# Altium schematic sheet P07-LCD.SchDoc
size 840 x 594 mm
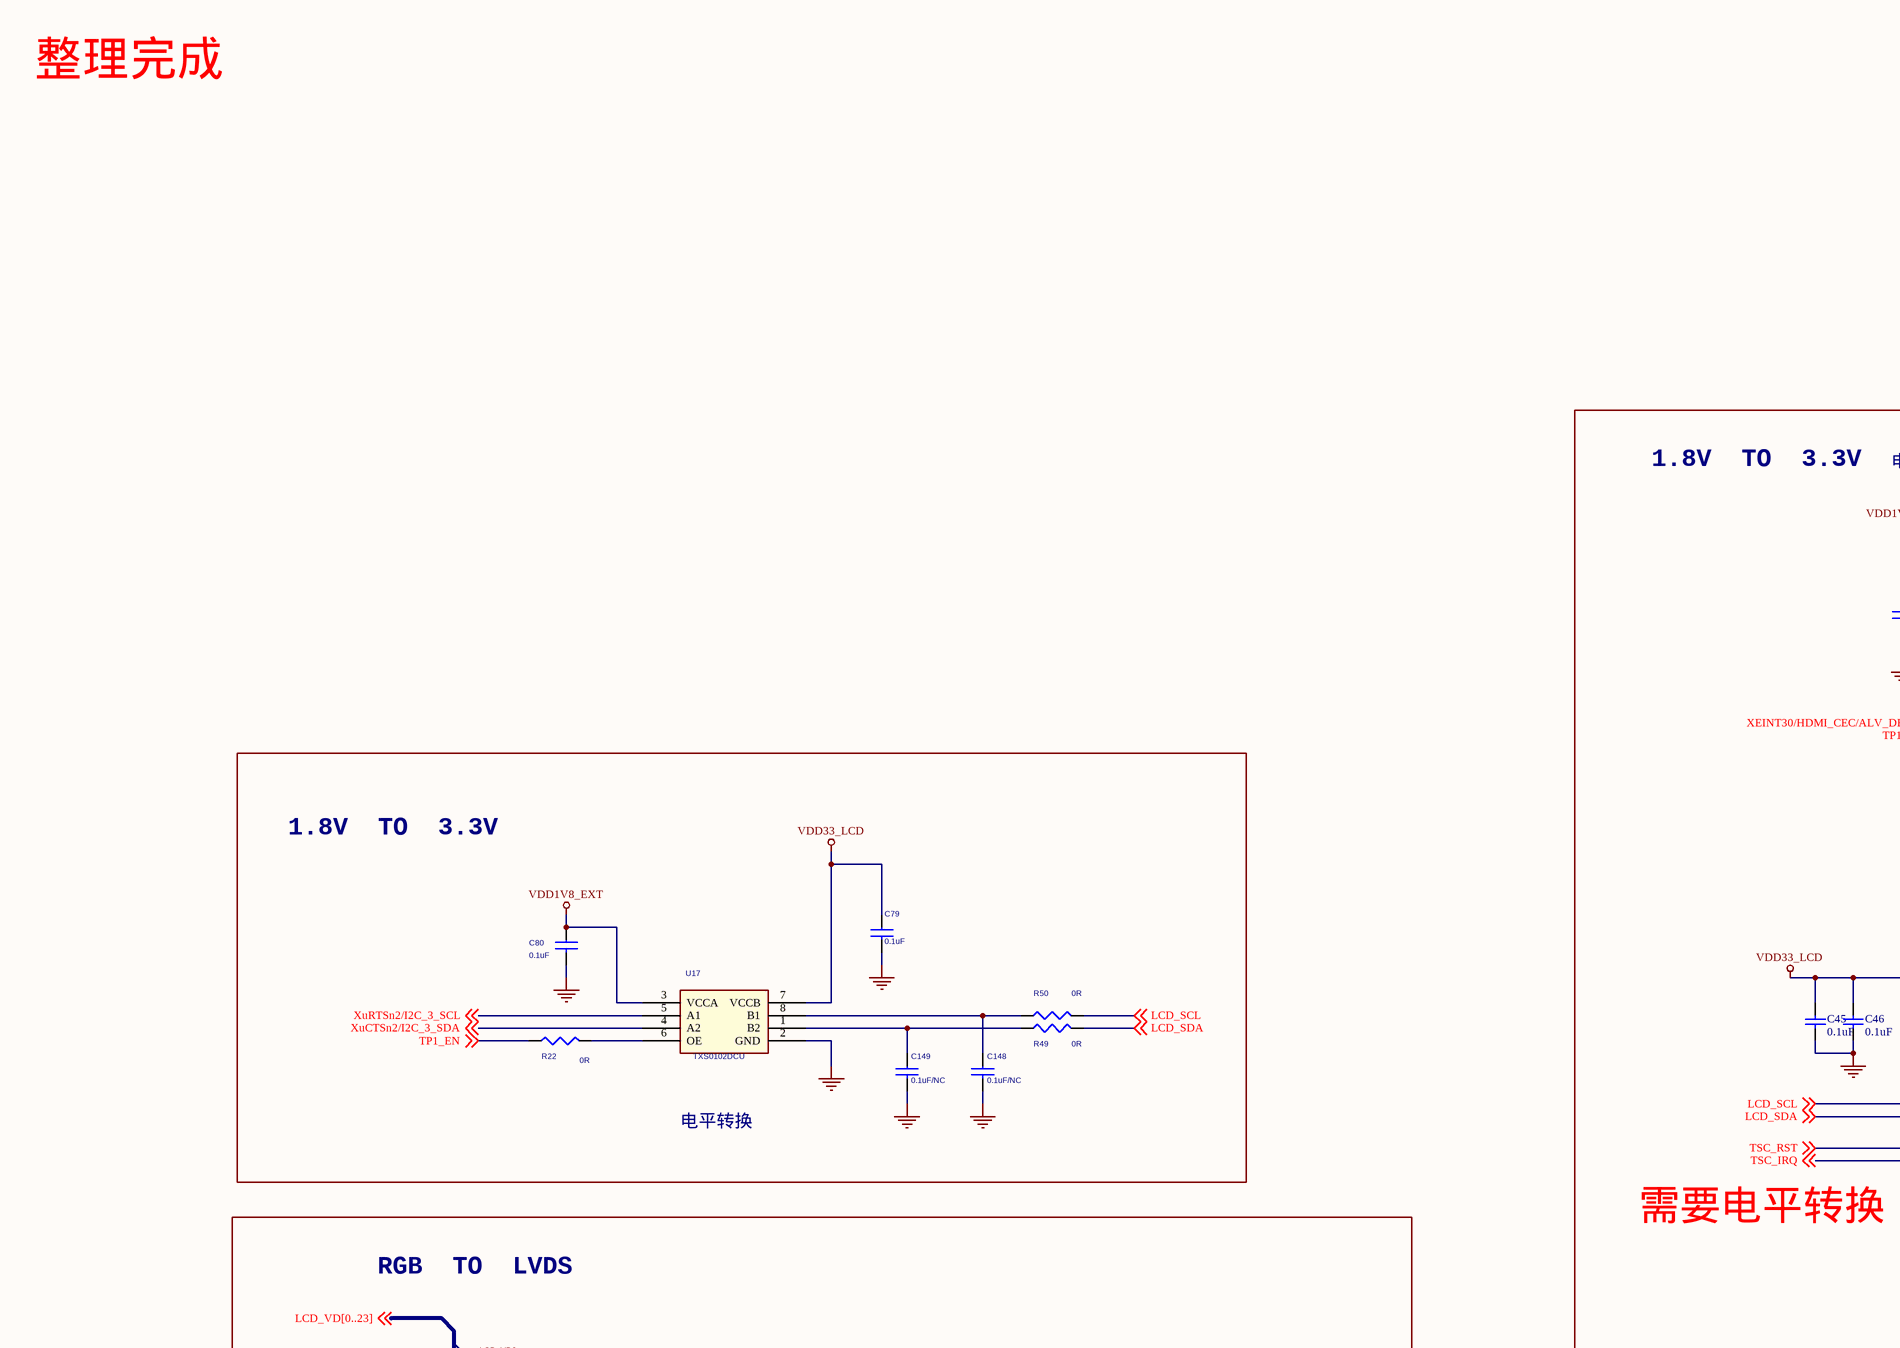
[diagram p0: P07-LCD.SchDoc, top left]
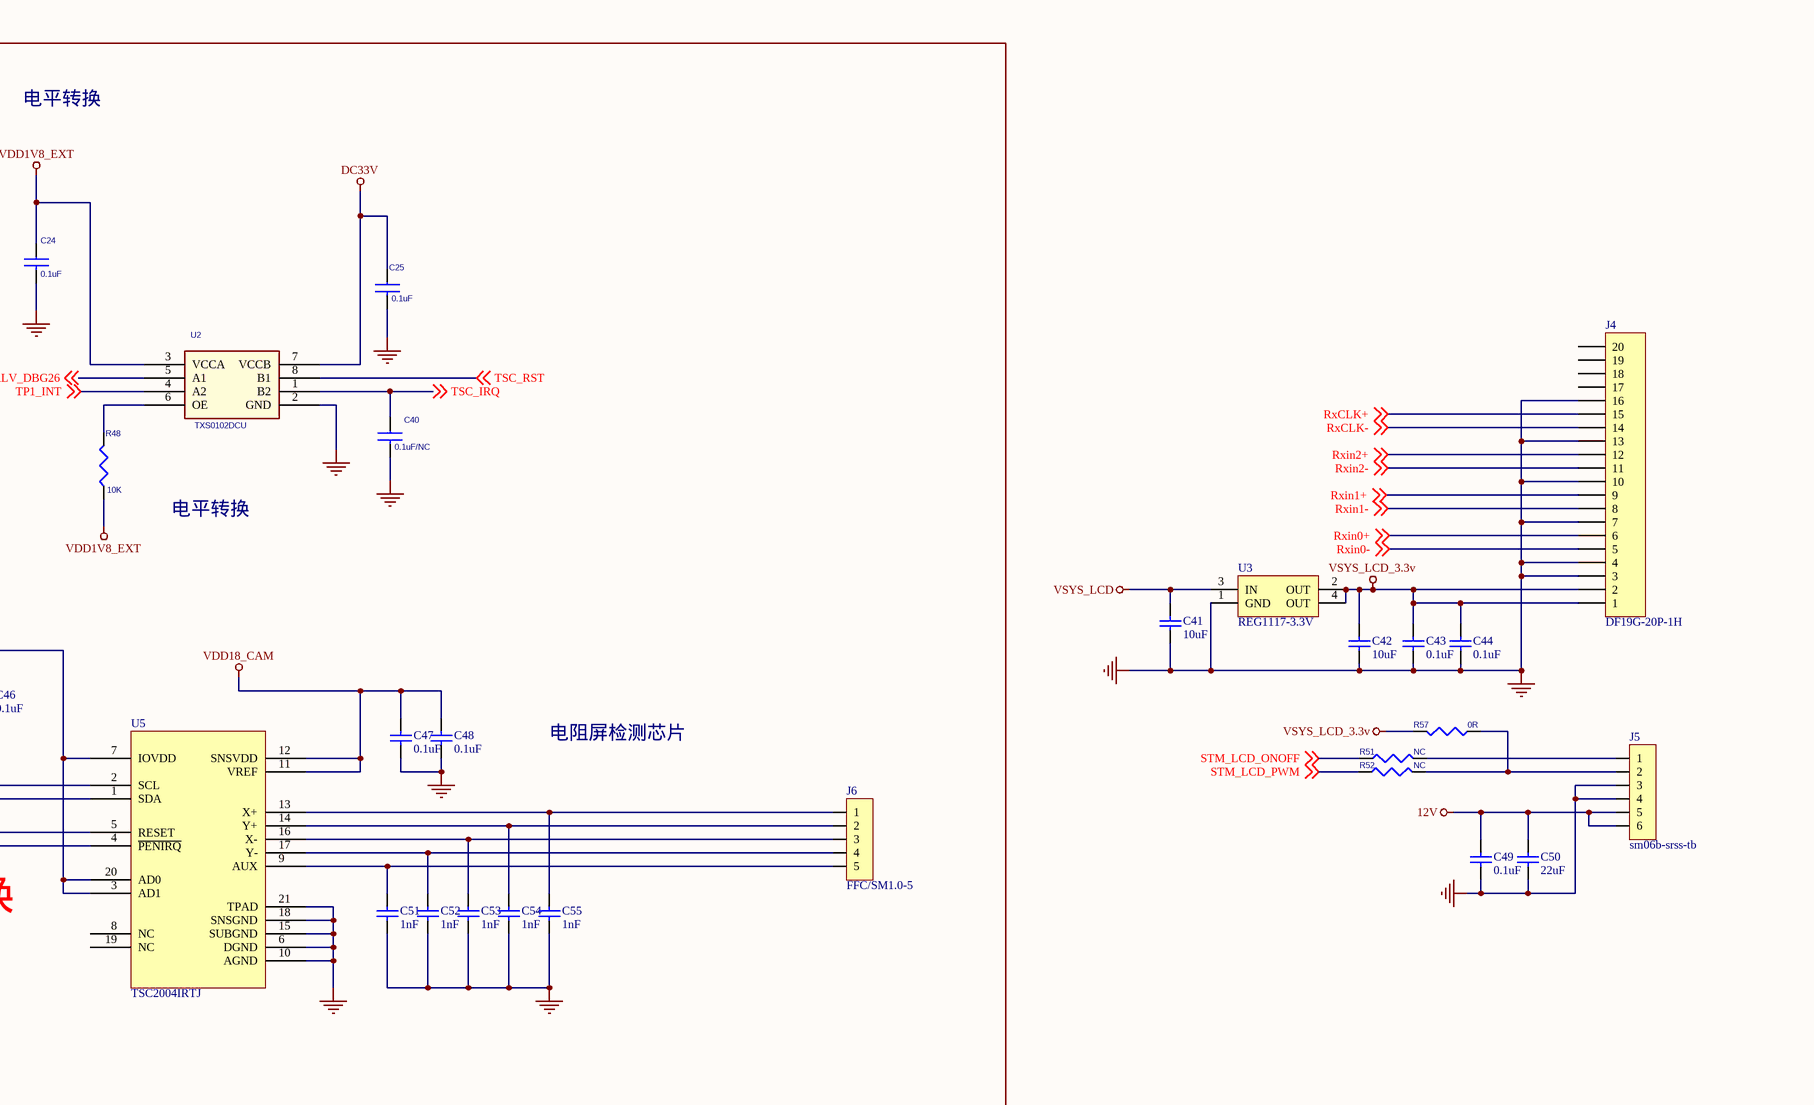
[diagram p1: P07-LCD.SchDoc, top right]
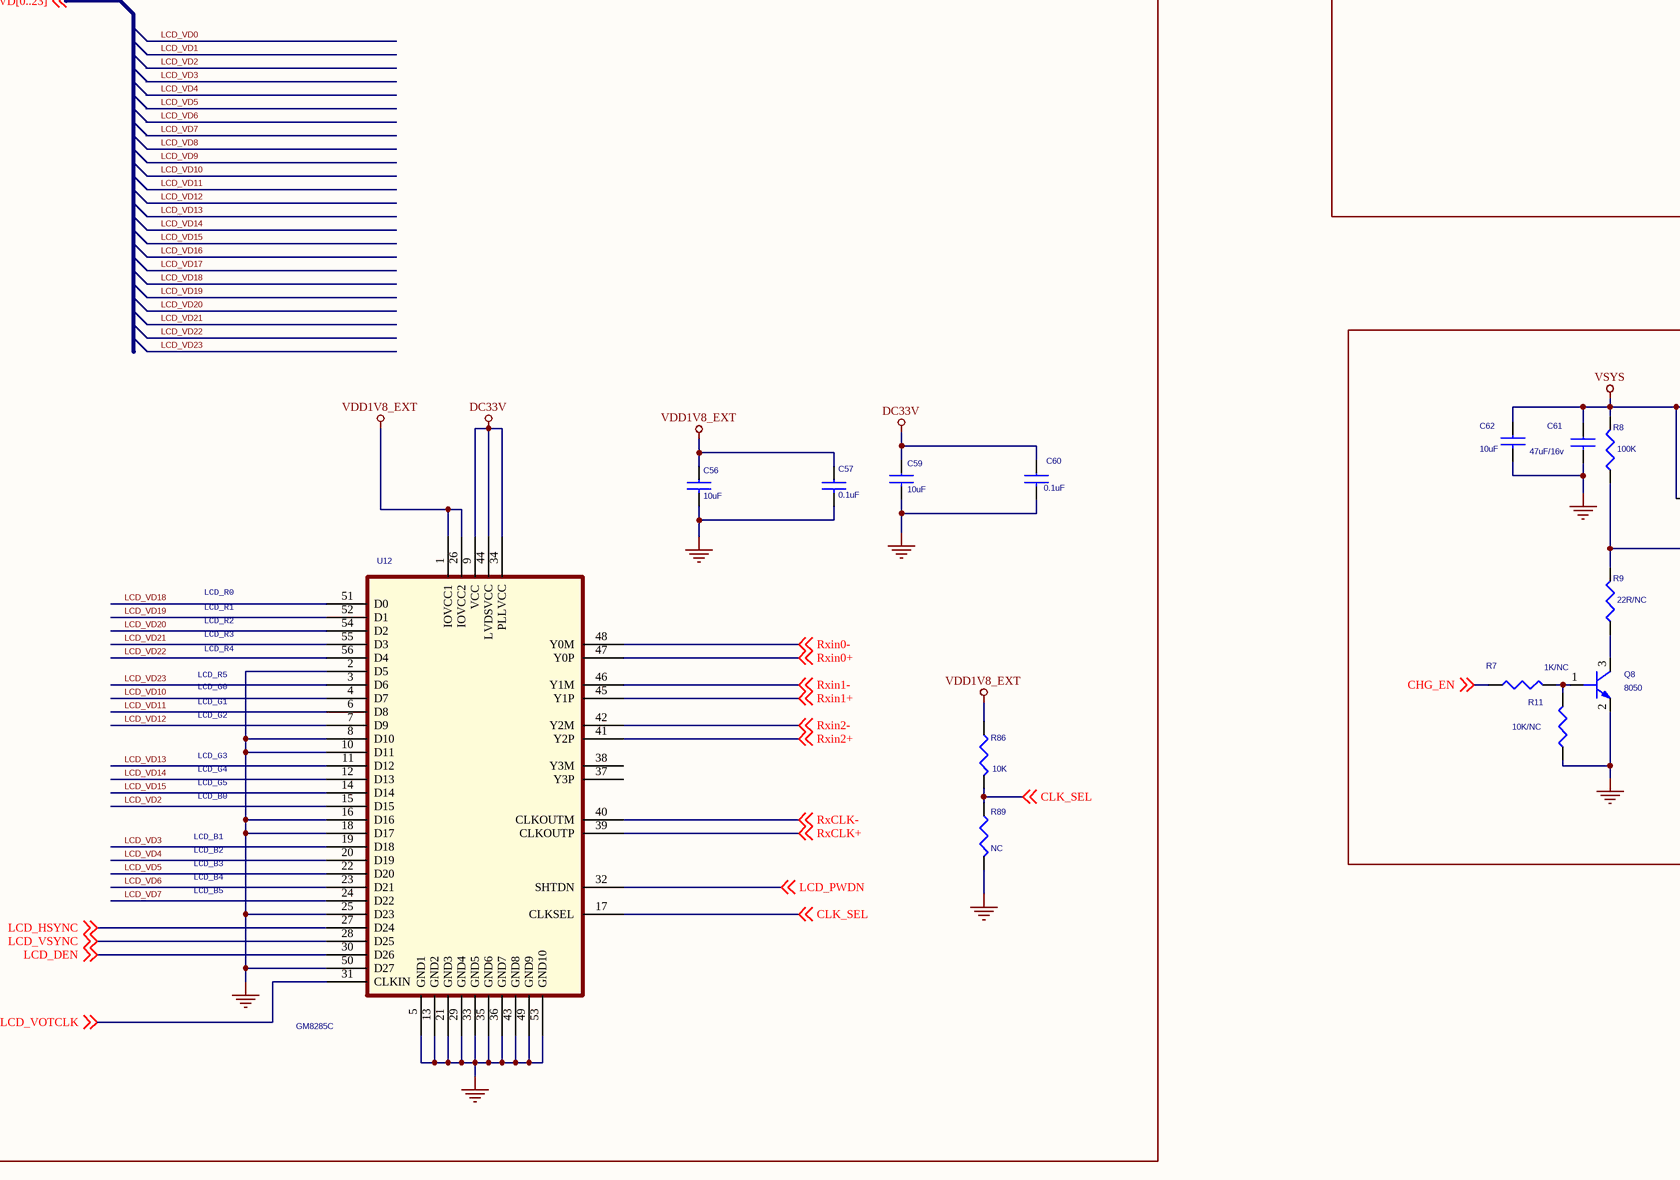
[diagram p2: P07-LCD.SchDoc, bottom left]
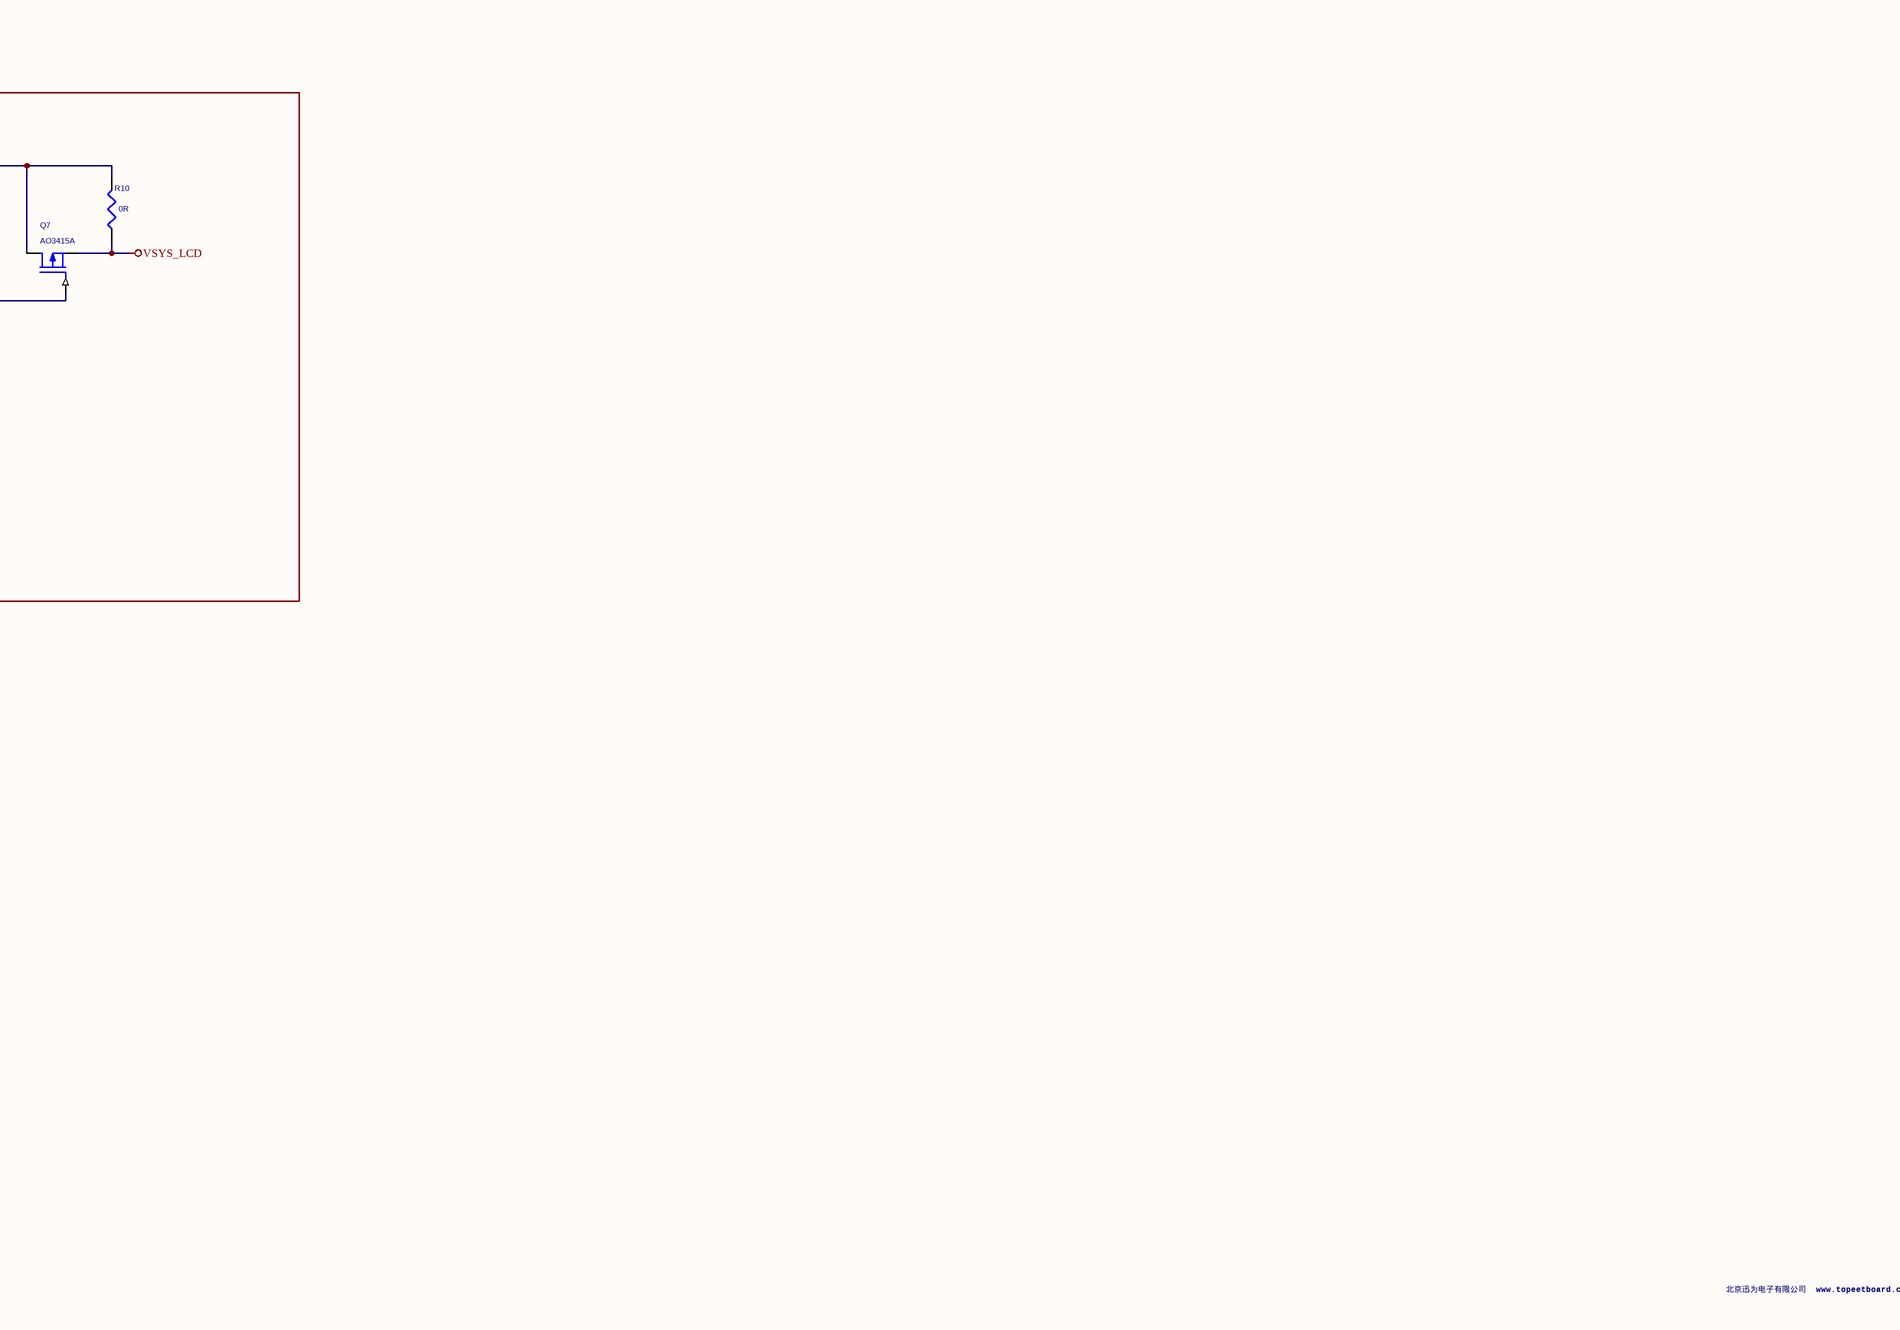
[diagram p3: P07-LCD.SchDoc, bottom right]

## Parts
C24  0.1uF  [C0603-S]
C25  0.1uF  [C0603-S]
C40  0.1uF/NC  [C0603-S]
C41  10uF  [C0603-s]
C42  10uF  [C0603-s]
C43  0.1uF  [C0603-s]
C44  0.1uF  [C0603-s]
C45  0.1uF  [C0603-S]
C46  0.1uF  [C0603-S]
C47  0.1uF  [C0603-S]
C48  0.1uF  [C0603-S]
C49  0.1uF  [C0603-s]
C50  22uF  [C0805-s]
C51  1nF  [C0603-S]
C52  1nF  [C0603-S]
C53  1nF  [C0603-S]
C54  1nF  [C0603-S]
C55  1nF  [C0603-S]
C56  10uF  [C0805-S]
C57  0.1uF  [C0603-S]
C59  10uF  [C0805-S]
C60  0.1uF  [C0603-S]
C61  47uF/16v  [C1206-S]
C62  10uF  [C0805-S]
C79  0.1uF  [C0603-S]
C80  0.1uF  [C0603-S]
C148  0.1uF/NC  [C0603-S]
C149  0.1uF/NC  [C0603-S]
J4  DF19G-20P-1H  [DF19G-20P-1H]
J5  sm06b-srss-tb  [sm06b-srss-tb]
J6  FFC/SM1.0-5  [FFC/SM1.0-5]
Q7  AO3415A  [SOT-23]
Q8  8050  [SOT-23]
R7  1K/NC  [R0603-S]
R8  100K  [R0603-S]
R9  22R/NC  [R0603-S]
R10  0R  [R0603-S]
R11  10K/NC  [R0603-S]
R22  0R  [R0603-S]
R48  10K  [R0603-S]
R49  0R  [R0603-S]
R50  0R  [R0603-S]
R51  NC  [R0603-S]
R52  NC  [R0603-S]
R57  0R  [R0603-S]
R86  10K  [R0603-S]
R89  NC  [R0603-S]
U2  TXS0102DCU  [tssop8]
U3  REG1117-3.3V  [SOT-223]
U5  TSC2004IRTJ  [QFN20]
U12  GM8285C  [TSSOP56]
U17  TXS0102DCU  [tssop8]

## Blocks framed on the sheet
需要电平转换: C24 C25 C40 C45-C48 C51-C55 J6 R48 U2 U5
1.8V  TO  3.3V: C79 C80 C148 C149 R22 R49 R50 U17
RGB  TO  LVDS: C56 C57 C59 C60 R86 R89 U12

## Nets
12V: C49.2 C50.2 J5.5 J5.6
DC33V: C25.1 C59.1 C60.1 U2.7(VCCB) U12.9(VCC) U12.34(PLLVCC) U12.44(LVDSVCC)
GND: C24.2 C25.2 C40.2 C41.1 C42.1 C43.1 C44.1 C45.1 C46.1 C47.1 C48.1 C49.1 C50.1 C51.1 C52.1 C53.1 C54.1 C55.1 C56.2 C57.2 C59.2 C60.2 C61.2 C62.2 C79.2 C80.2 C148.2 C149.2 J4.3 J4.4 J4.7 J4.10 J4.13 J4.16 J5.3 J5.4 Q8.2(EMITTER) R11.2 R89.2 U2.2(GND) U3.1(GND) U5.6(DGND) U5.10(AGND) U5.15(SUBGND) U5.18(SNSGND) U5.21(TPAD) U12.2(D5) U12.5(GND1) U12.8(D10) U12.10(D11) U12.13(GND2) U12.16(D16) U12.18(D17) U12.21(GND3) U12.25(D23) U12.29(GND4) U12.33(GND5) U12.35(GND6) U12.36(GND7) U12.43(GND8) U12.49(GND9) U12.50(D27) U12.53(GND10) U17.2(GND)
VDD1V8_EXT: C24.1 C56.1 C57.1 C80.1 R48.1 R86.1 U2.3(VCCA) U12.1(IOVCC1) U12.26(IOVCC2) U17.3(VCCA)
VDD18_CAM: C47.2 C48.2 U5.11(VREF) U5.12(SNSVDD)
VDD33_LCD: C45.2 C46.2 C79.1 U5.3(AD1) U5.7(IOVDD) U5.20(AD0) U17.7(VCCB)
VSYS: C61.1 C62.1 Q7.2(DRAIN) R8.1 R10.1
VSYS_LCD: C41.2 Q7.3(SOURCE) R10.2 U3.3(IN)
VSYS_LCD_3.3v: C42.2 C43.2 C44.2 J4.1 J4.2 R57.2 U3.2(OUT) U3.4(OUT)
CHG_EN: R7.2 ; off-sheet CHG_EN
CLK_SEL: R86.2 R89.1 U12.17(CLKSEL) ; off-sheet CLK_SEL
LCD_DEN: U12.30(D26) ; off-sheet LCD_DEN
LCD_HSYNC: U12.27(D24) ; off-sheet LCD_HSYNC
LCD_PWDN: U12.32(SHTDN) ; off-sheet LCD_PWDN
LCD_SCL: R50.2 U5.2(SCL) ; off-sheet LCD_SCL
LCD_SDA: R49.2 U5.1(SDA) ; off-sheet LCD_SDA
LCD_VD2: U12.15(D15)
LCD_VD3: U12.19(D18)
LCD_VD4: U12.20(D19)
LCD_VD5: U12.22(D20)
LCD_VD6: U12.23(D21)
LCD_VD7: U12.24(D22)
LCD_VD10: U12.4(D7)
LCD_VD11: U12.6(D8)
LCD_VD12: U12.7(D9)
LCD_VD13: U12.11(D12)
LCD_VD14: U12.12(D13)
LCD_VD15: U12.14(D14)
LCD_VD18: U12.51(D0)
LCD_VD19: U12.52(D1)
LCD_VD20: U12.54(D2)
LCD_VD21: U12.55(D3)
LCD_VD22: U12.56(D4)
LCD_VD23: U12.3(D6)
LCD_VOTCLK: U12.31(CLKIN) ; off-sheet LCD_VOTCLK
LCD_VSYNC: U12.28(D25) ; off-sheet LCD_VSYNC
RxCLK+: J4.15 U12.39(CLKOUTP) ; off-sheet RxCLK+
RxCLK-: J4.14 U12.40(CLKOUTM) ; off-sheet RxCLK-
Rxin0+: J4.6 U12.47(Y0P) ; off-sheet Rxin0+
Rxin0-: J4.5 U12.48(Y0M) ; off-sheet Rxin0-
Rxin1+: J4.9 U12.45(Y1P) ; off-sheet Rxin1+
Rxin1-: J4.8 U12.46(Y1M) ; off-sheet Rxin1-
Rxin2+: J4.12 U12.41(Y2P) ; off-sheet Rxin2+
Rxin2-: J4.11 U12.42(Y2M) ; off-sheet Rxin2-
STM_LCD_ONOFF: R51.1 ; off-sheet STM_LCD_ONOFF
STM_LCD_PWM: R52.1 ; off-sheet STM_LCD_PWM
TP1_EN: R22.1 ; off-sheet TP1_EN
TP1_INT: U2.4(A2) ; off-sheet TP1_INT
TSC_IRQ: C40.1 U2.1(B2) U5.4(~{PENIRQ}) ; off-sheet TSC_IRQ
TSC_RST: U2.8(B1) U5.5(RESET) ; off-sheet TSC_RST
XEINT30/HDMI_CEC/ALV_DBG26: U2.5(A1) ; off-sheet XEINT30/HDMI_CEC/ALV_DBG26
XuCTSn2/I2C_3_SDA: U17.4(A2) ; off-sheet XuCTSn2/I2C_3_SDA
XuRTSn2/I2C_3_SCL: U17.5(A1) ; off-sheet XuRTSn2/I2C_3_SCL
NetC51_2: C51.2 J6.5 U5.9(AUX)
NetC52_2: C52.2 J6.4 U5.17(Y-)
NetC53_2: C53.2 J6.3 U5.16(X-)
NetC54_2: C54.2 J6.2 U5.14(Y+)
NetC55_2: C55.2 J6.1 U5.13(X+)
NetC148_1: C148.1 R50.1 U17.8(B1)
NetC149_1: C149.1 R49.1 U17.1(B2)
NetJ5_1: J5.1 R51.2
NetJ5_2: J5.2 R52.2 R57.1
NetQ7_1: Q7.1(GATE) R8.2 R9.1
NetQ8_1: Q8.1(BASE) R7.1 R11.1
NetQ8_3: Q8.3(COLLECTOR) R9.2
NetR22_2: R22.2 U17.6(OE)
NetR48_2: R48.2 U2.6(OE)

Not connected (* = marked no-connect by the designer): J4 17 18 19 20; U5 8(NC) 19(NC); U12 37(Y3P) 38(Y3M)

## Notes on the sheet
- 整理完成
- 1.8V  TO  3.3V
- 电平转换
- 电阻屏检测芯片
- LCD_R0
- LCD_R1
- LCD_R2
- LCD_R3
- LCD_R5
- LCD_G0
- LCD_G1
- LCD_R4
- LCD_G2
- LCD_G3
- LCD_G4
- LCD_B1
- LCD_G5
- LCD_B0
- LCD_B2
- LCD_B3
- LCD_B4
- LCD_B5
- 北京迅为电子有限公司  www.topeetboard.com

## Library data of the parts
C24 C25 C40 C79 C80 = C0603_0
C41-C44 C49 C50 = CAP: Published: 8-Jun-2000; LatestRevisionDate: 17-Jul-2002; LatestRevisionNote: Re-released for DXP Platform.; PackageReference: RAD-0.3; Publisher: Altium Limited
  C41 C42: Value: 10uF
  C43 C44 C49: Value: 0.1uF
  C50: Value: 22uF
C45-C48 C51-C55 = Cap Semi
C56 C59 C61 C62 = C1608_Dup2
C57 C60 C148 C149 = C0402_0
J4 = Header 20: Header, 20-Pin; LatestRevisionDate: 17-Jul-2002; LatestRevisionNote: Re-released for DXP Platform.; Publisher: Altium Limited
J5 = HEADER1X6
J6 = HEADER1X5
Q7 = MOSFET P
Q8 = L14P2/TO_1
R7-R11 R22 R49-R52 R86 R89 = R1005_0_Dup1
R48 R57 = R0603_0
U2 U17 = TXS0102DCU_1
U3 = REG1117-3.3: 800mA and 1A Low Dropout Positive Regulator 2.85V, 3.3V, 5V, and Adjustable; Package Information: Latest Revision: revC; Published: 8-Jun-2000; Revision: 17-Jul-2002: Re-released for DXP Platform.; Datasheet: Latest Revision: Sep-1997; Package Reference: ZZ311; Publisher: Altium Limited
U5 = TSC2004IRTJ: Current Sensor
U12 = U-SN75LVDS83BDGG_3